# Altium schematic sheet MCU_CAN_Connectors.SchDoc
size A; SheetNumber: 2; SheetTotal: 3
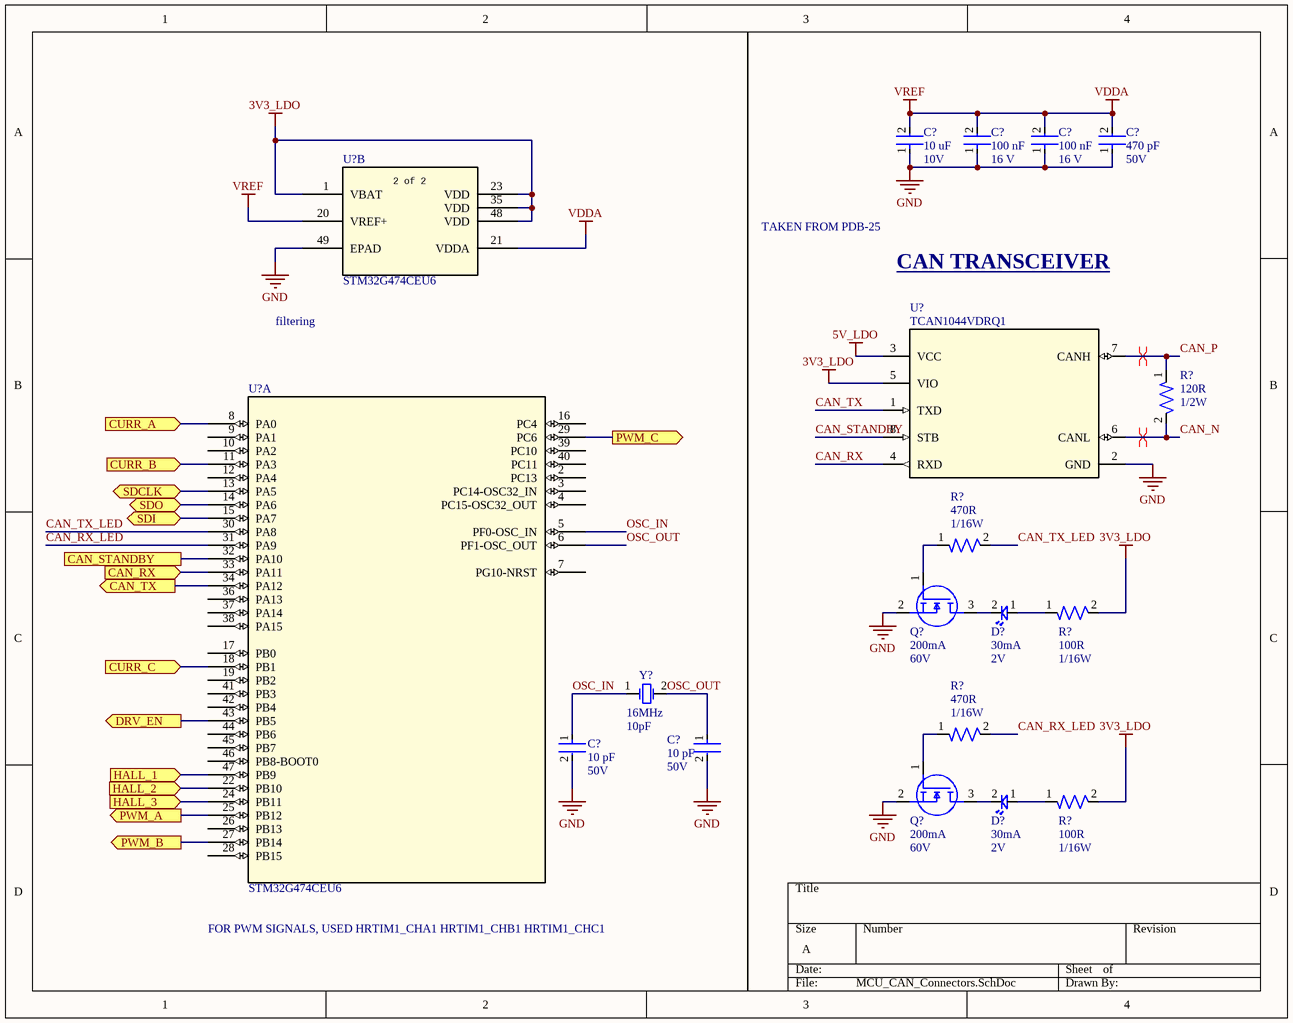
[diagram p0: MCU_CAN_Connectors.SchDoc]

## Parts
(Parts that share a designator on the sheet are numbered #1, #2 ... from top to bottom, then left to right.)
C?#1  Voltage: 10V  Capacitance: 10 uF  [CAP-0603]  (hidden comment: CC0603KRX5R6BB106)
C?#2  Voltage Rating: 16 V  Capacitance: 100 nF  [CAP-0402]  (hidden comment: CC0402KRX7R7BB104)
C?#3  Voltage Rating: 16 V  Capacitance: 100 nF  [CAP-0402]  (hidden comment: CC0402KRX7R7BB104)
C?#4  Voltage: 50V  Capacitance: 470 pF  [CAP-0805]  (hidden comment: CC0805JRNPO9BN471)
C?#5  Capacitance: 10 pF  Voltage: 50V  [CAP-0402]  (hidden comment: CC0402JRNPO9BN100)
C?#6  Capacitance: 10 pF  Voltage: 50V  [CAP-0402]  (hidden comment: CC0402JRNPO9BN100)
D?#1  Forward Current: 30mA  Forward Voltage: 2V  [LED-0603]  (hidden comment: BL-HKC36G-AV-TRB)
D?#2  Forward Current: 30mA  Forward Voltage: 2V  [LED-0603]  (hidden comment: BL-HKC36G-AV-TRB)
Q?#1  Continuous Current: 200mA  Voltage: 60V  [IC-SOT23-3]  (hidden comment: T2N7002AK,LM)
Q?#2  Continuous Current: 200mA  Voltage: 60V  [IC-SOT23-3]  (hidden comment: T2N7002AK,LM)
R?#1  Power: 1/2W  Resistance: 120R  [RES-1210]  (hidden comment: RC1210FR-07120RL)
R?#2  Power: 1/16W  Resistance: 470R  [RES-0402]  (hidden comment: RC0402FR-07470RL)
R?#3  Power: 1/16W  Resistance: 100R  [RES-0402]  (hidden comment: RC0402FR-07100RL)
R?#4  Power: 1/16W  Resistance: 470R  [RES-0402]  (hidden comment: RC0402FR-07470RL)
R?#5  Power: 1/16W  Resistance: 100R  [RES-0402]  (hidden comment: RC0402FR-07100RL)
U?#1  STM32G474CEU6  [IC-QFPN48]  (part B of 2)
U?#2  TCAN1044VDRQ1  [IC-8SOIC]
U?#3  STM32G474CEU6  [IC-QFPN48]  (part A of 2)
Y?  Capactiance: 10pF  Frequency: 16MHz  [CRYSTAL-4-SMD-0001]  (hidden comment: ABM10AIG-16.000MHZ-4Z-T3)

## Ports
CAN_RX (in), CAN_STANDBY, CAN_TX (out), CURR_A (in, see Driver[3B]), CURR_B (in, see Driver[3B]), CURR_C (in, see Driver[3B]), DRV_EN (out, see Driver[1B]), HALL_1 (in), HALL_2 (in), HALL_3 (in), PWM_A (out, see Driver[1B]), PWM_B (out, see Driver[1B]), PWM_C (out, see Driver[1B]), SDCLK (bidir), SDI (bidir), SDO (bidir)

## Nets
3V3_LDO: R?#3.2 R?#5.2 U?#1.1(VBAT) U?#1.23(VDD) U?#1.35(VDD) U?#1.48(VDD) U?#2.5(VIO)
5V_LDO: U?#2.3(VCC)
GND: C?#1.1 C?#2.1 C?#3.1 C?#4.1 C?#5.2 C?#6.2 Q?#1.2(S) Q?#2.2(S) U?#1.49(EPAD) U?#2.2(GND)
VDDA: C?#1.2 C?#2.2 C?#3.2 C?#4.2 U?#1.20(VREF+) U?#1.21(VDDA)  [also labelled VREF]
CAN_N: R?#1.2 U?#2.6(CANL)
CAN_P: R?#1.1 U?#2.7(CANH)
CAN_RX: U?#3.33(PA11) ; port CAN_RX
CAN_RX: U?#2.4(RXD)  [a separate net that carries the same name]
CAN_RX_LED: R?#4.2 U?#3.31(PA9)
CAN_STANDBY: U?#3.32(PA10) ; port CAN_STANDBY
CAN_STANDBY: U?#2.8(STB)  [a separate net that carries the same name]
CAN_TX: U?#3.34(PA12) ; port CAN_TX
CAN_TX: U?#2.1(TXD)  [a separate net that carries the same name]
CAN_TX_LED: R?#2.2 U?#3.30(PA8)
CURR_A: U?#3.8(PA0) ; port CURR_A
CURR_B: U?#3.11(PA3) ; port CURR_B
CURR_C: U?#3.18(PB1) ; port CURR_C
DRV_EN: U?#3.43(PB5) ; port DRV_EN
HALL_1: U?#3.47(PB9) ; port HALL_1
HALL_2: U?#3.22(PB10) ; port HALL_2
HALL_3: U?#3.24(PB11) ; port HALL_3
OSC_IN: C?#5.1 U?#3.5(PF0-OSC_IN) Y?.1(OSC1)
OSC_OUT: C?#6.1 U?#3.6(PF1-OSC_OUT) Y?.2(OSC2)
PWM_A: U?#3.25(PB12) ; port PWM_A
PWM_B: U?#3.27(PB14) ; port PWM_B
PWM_C: U?#3.29(PC6) ; port PWM_C
SDCLK: U?#3.13(PA5) ; port SDCLK
SDI: U?#3.15(PA7) ; port SDI
SDO: U?#3.14(PA6) ; port SDO
NetD?#1_1: D?#1.1 R?#3.1
NetD?#1_2: D?#1.2 Q?#1.3(D)
NetD?#2_1: D?#2.1 R?#5.1
NetD?#2_2: D?#2.2 Q?#2.3(D)
NetQ?#1_1: Q?#1.1(G) R?#2.1
NetQ?#2_1: Q?#2.1(G) R?#4.1

Not connected (* = marked no-connect by the designer): U?#3 2(PC13) 3(PC14-OSC32_IN) 4(PC15-OSC32_OUT) 7(PG10-NRST) 9(PA1) 10(PA2) 12(PA4) 16(PC4) 17(PB0) 19(PB2) 26(PB13) 28(PB15) 36(PA13) 37(PA14) 38(PA15) 39(PC10) 40(PC11) 41(PB3) 42(PB4) 44(PB6) 45(PB7) 46(PB8-BOOT0)

## Layout directives
differential pair: CAN_N, CAN_P

## Notes on the sheet
- TAKEN FROM PDB-25
- CAN TRANSCEIVER
- filtering
- FOR PWM SIGNALS, USED HRTIM1_CHA1 HRTIM1_CHB1 HRTIM1_CHC1
- (in symbol IC-STM32G474, part B) 2 of 2

## Library data of the parts
C?#1 = CAP-10U-0001: CAP CER 10UF 10V X5R 0603; ComponentLink1Description: Datasheet; ComponentLink1URL: https://www.yageo.com/upload/media/product/app/datasheet/mlcc/upy-gphc_x5r_4v-to-50v.pdf; Device Class: Ceramic; Size: 0603
C?#2 C?#3 = CAP-0.1U-0001: CAP CER 0.1UF 16V X7R 0402; ComponentLink2Description: Datasheet; ComponentLink2URL: https://www.yageo.com/upload/media/product/productsearch/datasheet/mlcc/UPY-GPHC_X7R_6.3V-to-250V_24.pdf; Device Class: Ceramic; Size: 0402
C?#4 = CAP-470P-0001: CAP CER 470PF 50V C0G/NPO 0805; Device Class: Ceramic; Size: 0805; ComponentLink1Description: Datasheet; ComponentLink1URL: https://www.yageo.com/upload/media/product/productsearch/datasheet/mlcc/UPY-GP_NP0_16V-to-50V_18.pdf
C?#5 C?#6 = CAP-10P-0001: CAP CER 10PF 50V C0G/NPO 0402; Device Class: Ceramic; Size: 0402; ComponentLink1Description: Datasheet; ComponentLink1URL: https://www.yageo.com/upload/media/product/productsearch/datasheet/mlcc/UPY-GP_NP0_16V-to-50V_18.pdf
D?#1 D?#2 = LED-0001: LED YELLOW CLEAR 0603 SMD; ComponentLink1Description: Datasheet; ComponentLink1URL: https://www.americanbrightled.com/pdffiles/led-components/smt/BL-HKC36G-AV-TRB.pdf
Q?#1 Q?#2 = NMOS-200MA-0001: MOSFET N-CH 60V 200MA SOT23; ComponentLink1Description: Datasheet; ComponentLink1URL: https://toshiba.semicon-storage.com/info/T2N7002AK_datasheet_en_20150401.pdf?did=29712&prodName=T2N7002AK
R?#1 = RES-120-0001: RES 120 OHM 1% 1/2W 1210; Tolerance: 1%; Size: 1210; ComponentLink1Description: Datasheet; ComponentLink1URL: https://www.yageo.com/upload/media/product/products/datasheet/rchip/PYu-RC_Group_51_RoHS_L_12.pdf
R?#2 R?#4 = RES-470-0001: RES 470 OHM 1% 1/16W 0402; Tolerance: 1%; Size: 0402; ComponentLink1Description: Datasheet; ComponentLink1URL: https://www.yageo.com/upload/media/product/products/datasheet/rchip/PYu-RC_Group_51_RoHS_L_12.pdf
R?#3 R?#5 = RES-100-0001: RES 100 OHM 1% 1/16W 0402; Tolerance: 1%; Size: 0402; ComponentLink1Description: Datasheet; ComponentLink1URL: https://www.yageo.com/upload/media/product/products/datasheet/rchip/PYu-RC_Group_51_RoHS_L_12.pdf
U?#1 U?#3 = IC-STM32G474: ARM® Cortex®-M4F STM32G4 Microcontroller IC 32-Bit 170MHz 512KB (512K x 8) FLASH 48-UFQFPN (7x7); Manufacturer_Name: STMicroelectronics; Copyright: Copyright (C) 2025 Ultra Librarian. All rights reserved.; Manufacturer_Part_Number: STM32G474CEU6; RefDes: RefDes; Type: Type
U?#2 = IC-CAN-0001: IC TRANSCEIVER 1/1 8SOIC; ComponentLink1Description: Datasheet; ComponentLink1URL: https://www.ti.com/lit/ds/symlink/tcan1044-q1.pdf?HQS=dis-dk-null-digikeymode-dsf-pf-null-wwe&ts=1728758303289&ref_url=https%253A%252F%252Fwww.ti.com%252Fgeneral%252Fdocs%252Fsuppproductinfo.tsp%253FdistId%253D10%2526gotoUrl%253Dhttps%253A%252F%252Fwww.ti.com%252Flit%252Fgpn%252Ftcan1044-q1
Y? = CRYSTAL-16MHz-0001: 16 MHz ±30ppm Crystal 10pF 80 Ohms 4-SMD, No Lead